# EAGLE schematic mrShark 05.a (EAGLE 6.1)

## Sheet 1 of 2
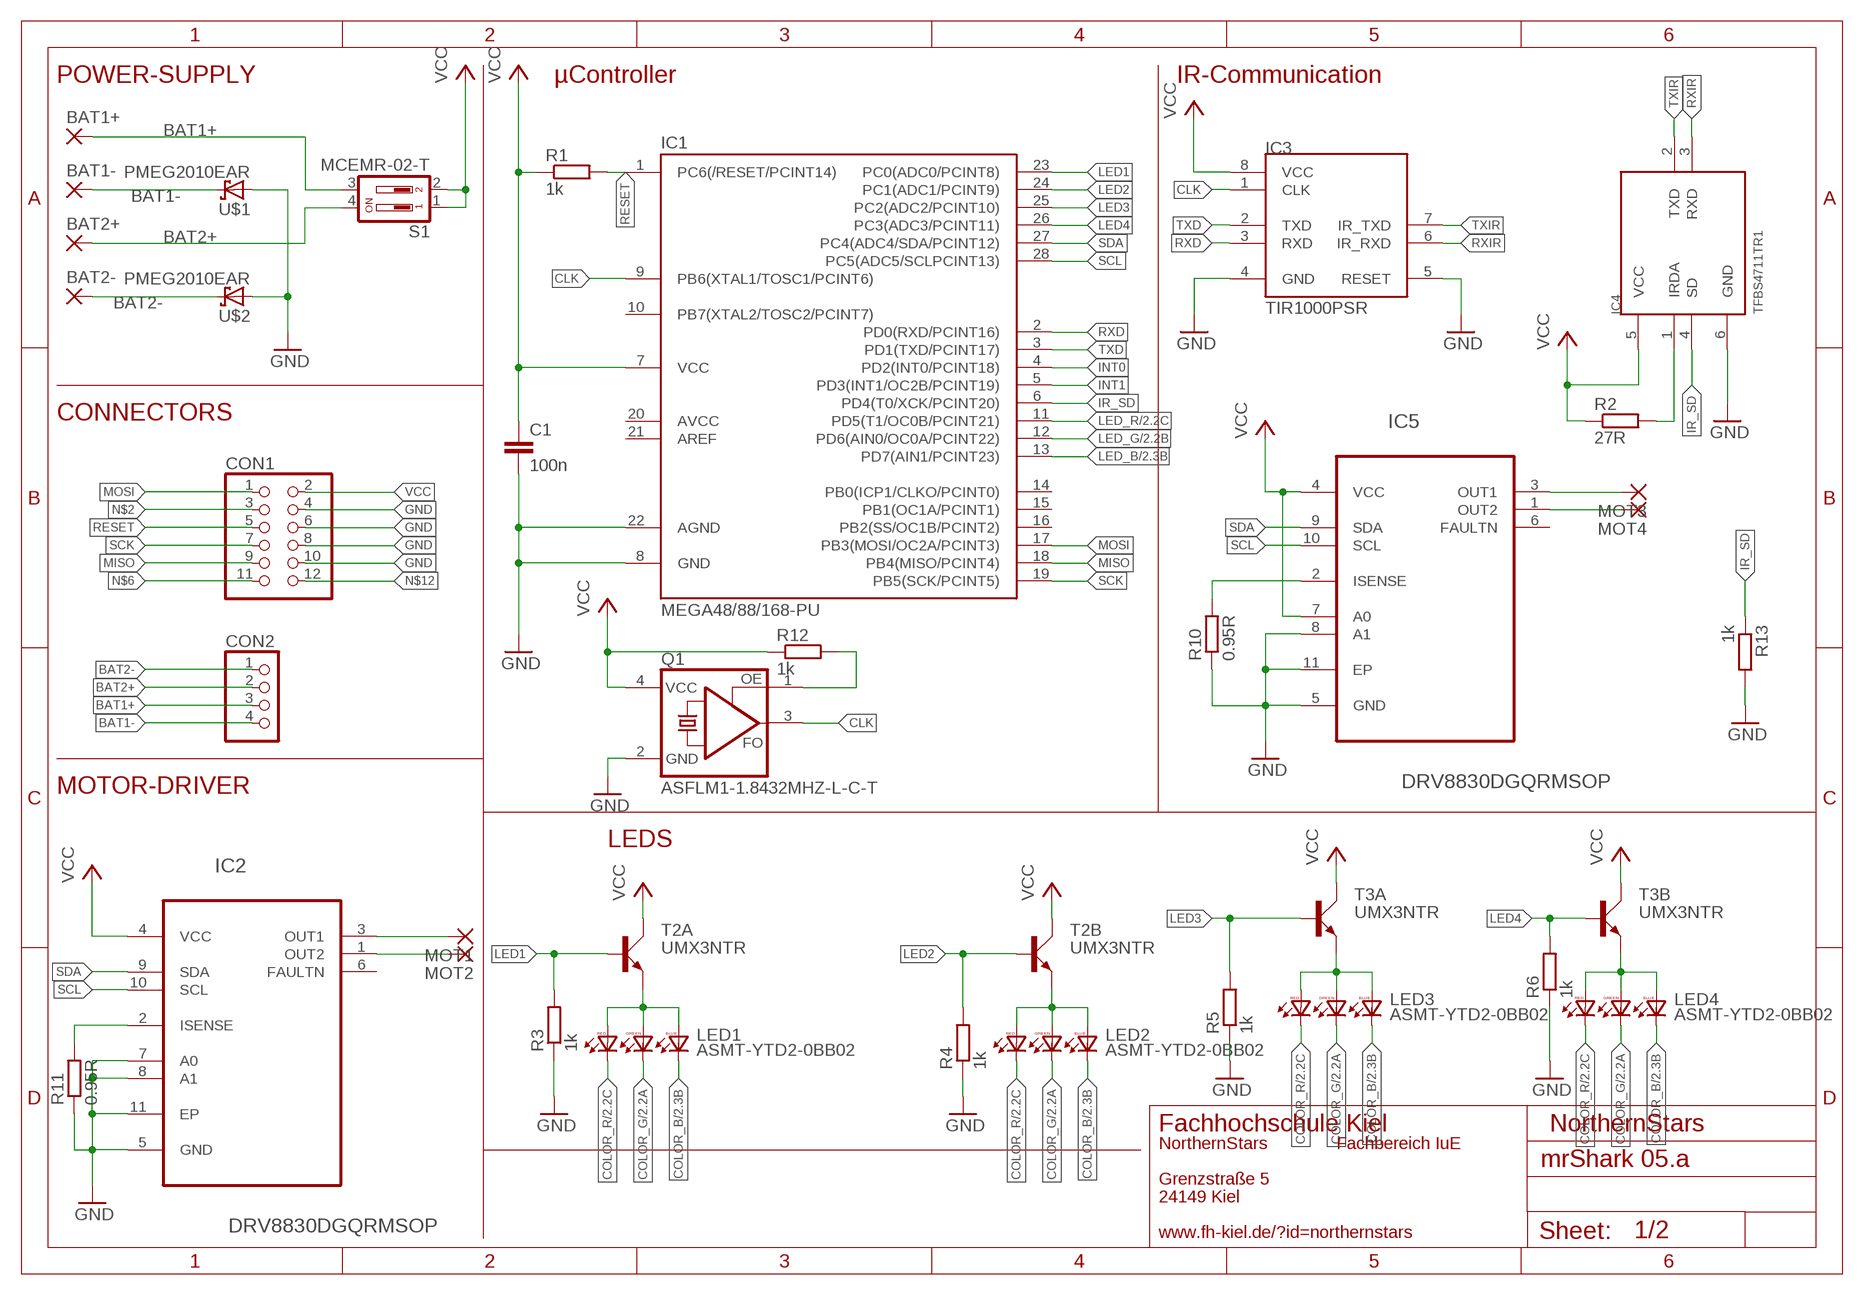
[diagram p0: schematic, sheet 1]

### Parts
BAT1+  1,6/0,9  [1,6/0,9]
BAT1-  1,6/0,9  [1,6/0,9]
BAT2+  1,6/0,9  [1,6/0,9]
BAT2-  1,6/0,9  [1,6/0,9]
C1  100n  C-EUC1206  [C1206]
CON1  PINHD-2X06_2.54-SMD  [2X06SMD]
CON2  PINHD-1X04_2.54-SMD-90°  [1X04SMD/90]
IC1  MEGA48/88/168-PU  [DIL28-3]
IC2  DRV8830DGQRMSOP  [SOP65P640X110-15N]
IC3  TIR1000PSR  [SO-08]
IC4  TFBS4711TR1  [TFBS4711]
IC5  DRV8830DGQRMSOP  [SOP65P640X110-15N]
LED1  ASMT-YTD2-0BB02  PLCC6  [PLCC6]
LED2  ASMT-YTD2-0BB02  PLCC6  [PLCC6]
LED3  ASMT-YTD2-0BB02  PLCC6  [PLCC6]
LED4  ASMT-YTD2-0BB02  PLCC6  [PLCC6]
MOT1  1,6/0,9  [1,6/0,9]
MOT2  1,6/0,9  [1,6/0,9]
MOT3  1,6/0,9  [1,6/0,9]
MOT4  1,6/0,9  [1,6/0,9]
Q1  ASFLM1-1.8432MHZ-L-C-T  HC536R  [HC536]
R1  1k  R-EU_R1206  [R1206]
R2  27R  R-EU_R1206  [R1206]
R3  1k  R-EU_R1206  [R1206]
R4  1k  R-EU_R1206  [R1206]
R5  1k  R-EU_R1206  [R1206]
R6  1k  R-EU_R1206  [R1206]
R10  0.95R  R-EU_R1206  [R1206]
R11  0.95R  R-EU_R1206  [R1206]
R12  1k  R-EU_R1206  [R1206]
R13  1k  R-EU_R1206  [R1206]
S1  MCEMR-02-T  219-02  [CTS-219-02]
T2  UMX3NTR  UMX3NTR-SOT363  [SOT363_INFINEON]
T3  UMX3NTR  UMX3NTR-SOT363  [SOT363_INFINEON]
U$1  PMEG2010EAR  [SOD323-R]
U$2  PMEG2010EAR  [SOD323-R]

### Nets
BAT1+: BAT1+.1(P) CON2.3 S1.3
BAT1-: BAT1-.1(P) CON2.4 U$1.C
BAT2+: BAT2+.1(P) CON2.2 S1.4
BAT2-: BAT2-.1(P) CON2.1 U$2.C
CLK: IC1.9(PB6(XTAL1/TOSC1/PCINT6)) IC3.1(CLK) Q1.3(FO)
COLOR_B: LED1.1(BC) LED2.1(BC) LED3.1(BC) LED4.1(BC) ; also sheet 2
COLOR_G: LED1.2(GC) LED2.2(GC) LED3.2(GC) LED4.2(GC) ; also sheet 2
COLOR_R: LED1.3(RC) LED2.3(RC) LED3.3(RC) LED4.3(RC) ; also sheet 2
GND: C1.2 CON1.4 CON1.6 CON1.8 CON1.10 IC1.8(GND) IC1.22(AGND) IC2.5(GND) IC2.7(A0) IC2.8(A1) IC2.11(EP) IC3.4(GND) IC3.5(RESET) IC4.6(GND) IC5.5(GND) IC5.8(A1) IC5.11(EP) Q1.2(GND) R3.1 R4.1 R5.1 R6.1 R10.1 R11.1 R13.2 U$1.A U$2.A ; also sheet 2
INT0: IC1.4(PD2(INT0/PCINT18))
INT1: IC1.5(PD3(INT1/OC2B/PCINT19))
IR_SD: IC1.6(PD4(T0/XCK/PCINT20)) IC4.4(SD) R13.1
IRDA: IC4.1(IRDA) R2.2
LED1: IC1.23(PC0(ADC0/PCINT8)) R3.2 T2.2(A:B)
LED1+: LED1.4(RA) LED1.5(GA) LED1.6(BA) T2.1(A:E)
LED2: IC1.24(PC1(ADC1/PCINT9)) R4.2 T2.3(B:B)
LED2+: LED2.4(RA) LED2.5(GA) LED2.6(BA) T2.5(B:E)
LED3: IC1.25(PC2(ADC2/PCINT10)) R5.2 T3.2(A:B)
LED3+: LED3.4(RA) LED3.5(GA) LED3.6(BA) T3.1(A:E)
LED4: IC1.26(PC3(ADC3/PCINT11)) R6.2 T3.3(B:B)
LED4+: LED4.4(RA) LED4.5(GA) LED4.6(BA) T3.5(B:E)
LED_B: IC1.13(PD7(AIN1/PCINT23)) ; also sheet 2
LED_G: IC1.12(PD6(AIN0/OC0A/PCINT22)) ; also sheet 2
LED_R: IC1.11(PD5(T1/OC0B/PCINT21)) ; also sheet 2
MISO: CON1.9 IC1.18(PB4(MISO/PCINT4))
MOSI: CON1.1 IC1.17(PB3(MOSI/OC2A/PCINT3))
N$1: IC5.3(OUT1) MOT3.1(P)
N$2: CON1.3
N$3: IC5.1(OUT2) MOT4.1(P)
N$4: Q1.1(OE) R12.2
N$5: IC5.2(ISENSE) R10.2
N$6: CON1.11
N$7: IC2.2(ISENSE) R11.2
N$12: CON1.12
N$15: IC2.3(OUT1) MOT1.1(P)
N$16: IC2.1(OUT2) MOT2.1(P)
RESET: CON1.5 IC1.1(PC6(/RESET/PCINT14)) R1.2
RXD: IC1.2(PD0(RXD/PCINT16)) IC3.3(RXD)
RXIR: IC3.6(IR_RXD) IC4.3(RXD)
SCK: CON1.7 IC1.19(PB5(SCK/PCINT5))
SCL: IC1.28(PC5(ADC5/SCLPCINT13)) IC2.10(SCL) IC5.10(SCL)
SDA: IC1.27(PC4(ADC4/SDA/PCINT12)) IC2.9(SDA) IC5.9(SDA)
TXD: IC1.3(PD1(TXD/PCINT17)) IC3.2(TXD)
TXIR: IC3.7(IR_TXD) IC4.2(TXD)
VCC: C1.1 CON1.2 IC1.7(VCC) IC2.4(VCC) IC3.8(VCC) IC4.5(VCC) IC5.4(VCC) IC5.7(A0) Q1.4(VCC) R1.1 R2.1 R12.1 S1.1 S1.2 T2.4(B:C) T2.6(A:C) T3.4(B:C) T3.6(A:C)
Unconnected: IC1.10(PB7(XTAL2/TOSC2/PCINT7)) IC1.14(PB0(ICP1/CLKO/PCINT0)) IC1.15(PB1(OC1A/PCINT1)) IC1.16(PB2(SS/OC1B/PCINT2)) IC1.20(AVCC) IC1.21(AREF) IC2.6(FAULTN) IC5.6(FAULTN)

### Notes on the sheet
- POWER-SUPPLY | µController | IR-Communication
- CONNECTORS
- MOTOR-DRIVER
- LEDS
- Fachhochschule Kiel | NorthernStars
- NorthernStars | Fachbereich IuE
- Grenzstraße 5
- 24149 Kiel
- www.fh-kiel.de/?id=northernstars

## Sheet 2 of 2
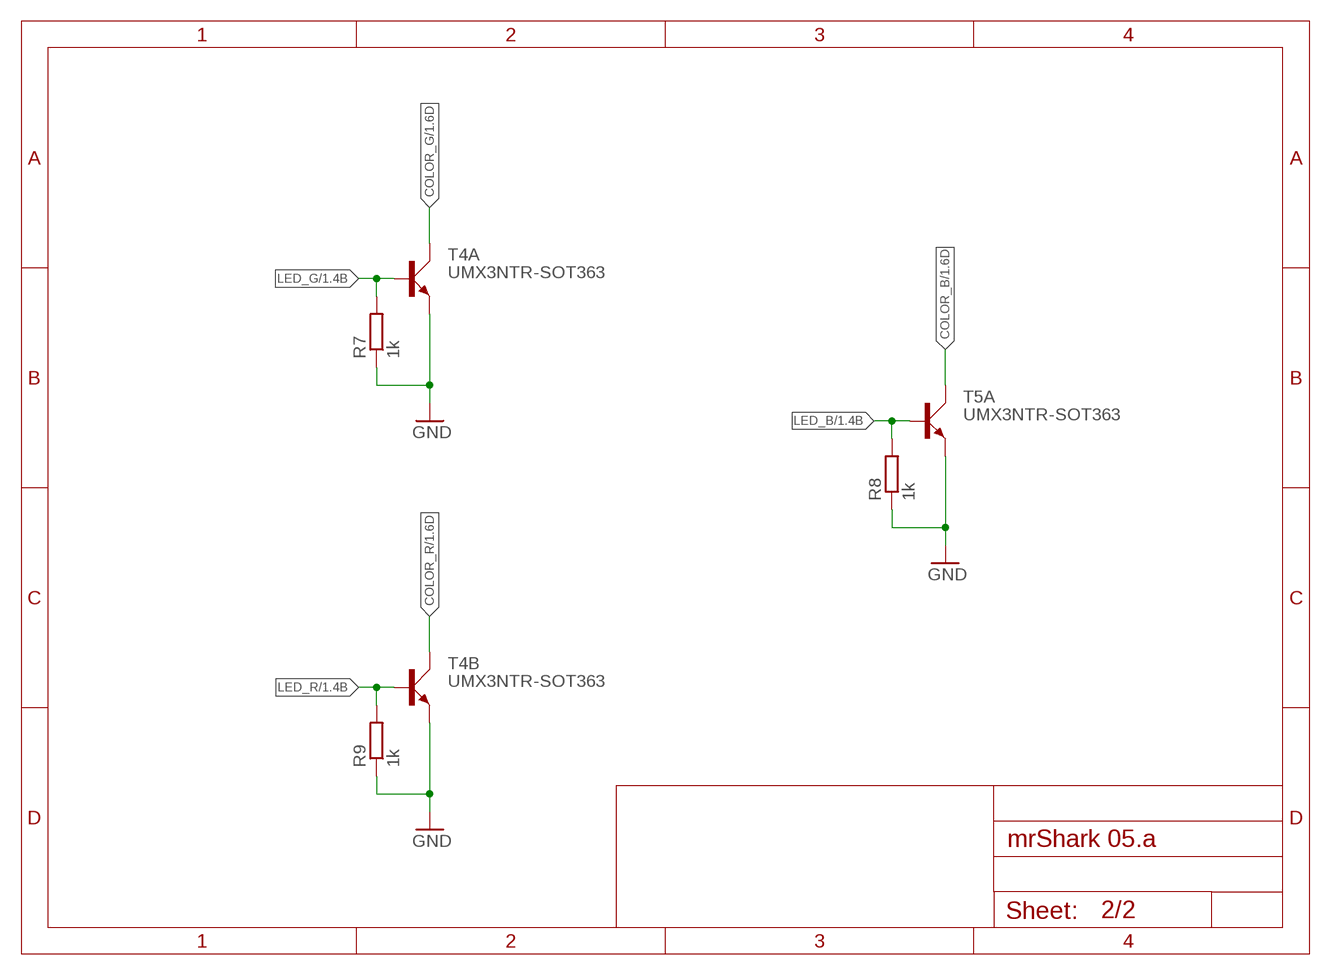
[diagram p1: schematic, sheet 2]

### Parts
R7  1k  R-EU_R1206  [R1206]
R8  1k  R-EU_R1206  [R1206]
R9  1k  R-EU_R1206  [R1206]
T4  UMX3NTR-SOT363  [SOT363_INFINEON]
T5  UMX3NTR-SOT363  [SOT363_INFINEON]

### Nets
COLOR_B: T5.6(A:C) ; also sheet 1
COLOR_G: T4.6(A:C) ; also sheet 1
COLOR_R: T4.4(B:C) ; also sheet 1
GND: R7.1 R8.1 R9.1 T4.1(A:E) T4.5(B:E) T5.1(A:E) ; also sheet 1
LED_B: R8.2 T5.2(A:B) ; also sheet 1
LED_G: R7.2 T4.2(A:B) ; also sheet 1
LED_R: R9.2 T4.3(B:B) ; also sheet 1
Unconnected: T5.3(B:B) T5.4(B:C) T5.5(B:E)

## Library data of the parts
BAT1+ BAT1- BAT2+ BAT2- MOT1-MOT4 = wirepad:1,6/0,9: THROUGH-HOLE PAD
C1 = rcl:C-EU: CAPACITOR, European symbol
CON1 = pinhead-2:PINHD-2X06: PIN HEADER
CON2 = pinhead-2:PINHD-1X04: PIN HEADER
IC1 = avr-6:MEGA48/88/168-PU
IC2 IC5 = texas:DRV8830DGQR: LOW-VOLTAGE MOTOR DRIVER WITH SERIAL INTERFACE; MPN: DRV8830DGQR; OC_FARNELL: 1863106; OC_NEWARK: 58T1482; PACKAGE: MSOP-10; SUPPLIER: TEXAS INSTRUMENTS
IC3 = texas:TIR1000: Texas Instruments TIR1000 STANDALONE IrDATM ENCODER AND DECODER
IC4 = vishay:TFBS4711: TRANSCEIVER IRDA Vishay TFBS4711-TR1 Infrared Transciever 900nm, 600µA, 1m range
LED1-LED4 = led:PLCC6: Standart PLCC6 Package RGB LED
Q1 = crystal:HC536: Crystal HC536R For example: Fox Electronics FOX-HC536R
R1-R13 = rcl:R-EU_: RESISTOR, European symbol
S1 = switch-dil:219-02*: Surface Mount DIP Switch Series 219 SMT CTS Electronic Components Sourc: www.ctscorp.com
T2-T5 = transistor-small-signal:UMX3NTR: DUAL NPN Transistor UMX3NTR Uce = 50V Ic = 150mA Pd = 150mW
U$1 U$2 = diode:PMEG2010EA: NXP - Low V F (MEGA) Schottky barrier diode If = 1A, Vr = 20V http://www.farnell.com/datasheets/687996.pdf